# Altium schematic sheet power.SchDoc
size A
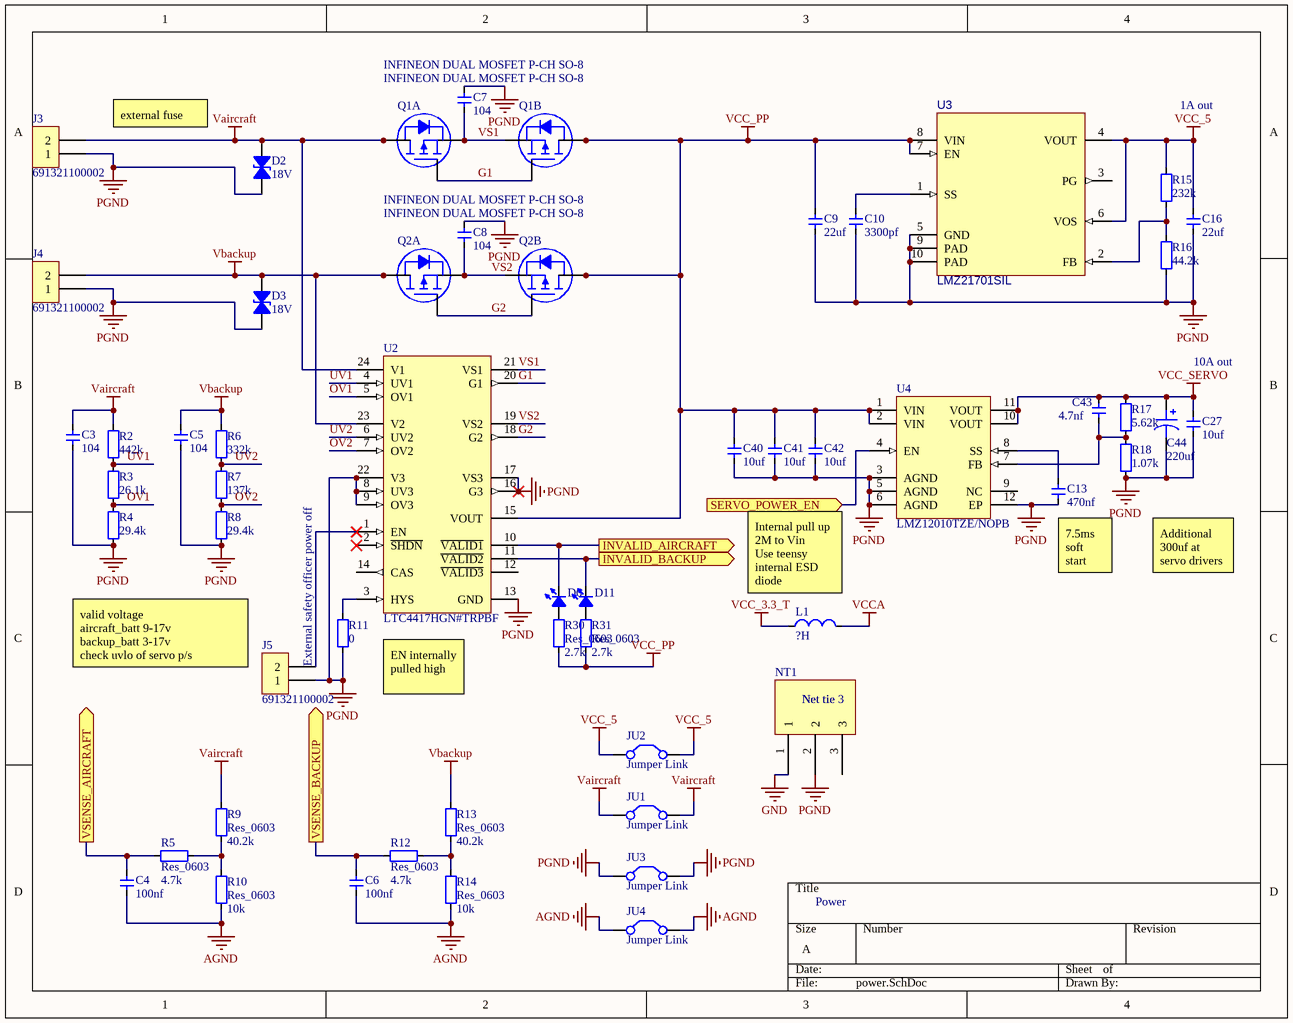
[diagram p0: power.SchDoc]

## Parts
C3  value 104  [CAP_0603]  (hidden comment: Cap_0603)
C4  value 100nf  [CAP_0603]  (hidden comment: Cap_0603)
C5  value 104  [CAP_0603]  (hidden comment: Cap_0603)
C6  value 100nf  [CAP_0603]  (hidden comment: Cap_0603)
C7  value 104  [CAP_0603]  (hidden comment: Cap_0603)
C8  value 104  [CAP_0603]  (hidden comment: Cap_0603)
C9  value 22uf  [CAP_0805]  (hidden comment: Cap_0805)
C10  value 3300pf  [CAP_0603]  (hidden comment: Cap_0603)
C13  value 470nf  [CAP_0603]  (hidden comment: Cap_0603)
C16  value 22uf  [CAP_0805]  (hidden comment: Cap_0805)
C27  value 10uf  [CAP_0805]  (hidden comment: Cap_0805)
C40  value 10uf  [CAP_0805]  (hidden comment: Cap_0805)
C41  value 10uf  [CAP_0805]  (hidden comment: Cap_0805)
C42  value 10uf  [CAP_0805]  (hidden comment: Cap_0805)
C43  value 4.7nf  [CAP_0603]  (hidden comment: Cap_0603)
C44  220uf  [CAP ALUM 8.3MM]
D2  18V  [SOD123F]
D3  18V  [SOD123F]
D6  LED_0603  [LED_0603_GREEN]  (value not drawn)
D11  LED_0603  [LED_0603_GREEN]  (value not drawn)
J3  691321100002  [691322110002]
J4  691321100002  [691322110002]
J5  691321100002  [62000211121]
JU1  Jumper Link  [jumper_56.5]
JU2  Jumper Link  [jumper_43.5]
JU3  Jumper Link  [jumper_12]
JU4  Jumper Link  [jumper_52]
L1  value ?H  [IND_0603]  (hidden comment: Ind_0603)
NT1  Net tie 3  [Net tie 3]  (net tie, no BOM)
Q1  INFINEON DUAL MOSFET P-CH SO-8  [INFINEON SO-8]  (parts A,B of 2)
Q2  INFINEON DUAL MOSFET P-CH SO-8  [INFINEON SO-8]  (parts A,B of 2)
R2  value 442k  [RES_0603]  (hidden comment: Res_0603)
R3  value 26.1k  [RES_0603]  (hidden comment: Res_0603)
R4  value 29.4k  [RES_0603]  (hidden comment: Res_0603)
R5  Res_0603  value 4.7k  [RES_0603]
R6  value 332k  [RES_0603]  (hidden comment: Res_0603)
R7  value 137k  [RES_0603]  (hidden comment: Res_0603)
R8  value 29.4k  [RES_0603]  (hidden comment: Res_0603)
R9  Res_0603  value 40.2k  [RES_0603]
R10  Res_0603  value 10k  [RES_0603]
R11  value 0  [RES_0603]  (hidden comment: Res_0603)
R12  Res_0603  value 4.7k  [RES_0603]
R13  Res_0603  value 40.2k  [RES_0603]
R14  Res_0603  value 10k  [RES_0603]
R15  value 232k  [RES_0603]  (hidden comment: Res_0603)
R16  value 44.2k  [RES_0603]  (hidden comment: Res_0603)
R17  value 5.62k  [RES_0603]  (hidden comment: Res_0603)
R18  value 1.07k  [RES_0603]  (hidden comment: Res_0603)
R30  Res_0603  value 2.7k  [RES_0603]
R31  Res_0603  value 2.7k  [RES_0603]
U2  LTC4417HGN#TRPBF  [LT-GN-24_N]
U3  LMZ21701SIL  [LMZ21701SIL]
U4  LMZ12010TZE/NOPB  [TZA11A_V]

## Ports
INVALID_AIRCRAFT (out), INVALID_BACKUP (out), SERVO_POWER_EN (in), VSENSE_AIRCRAFT (out), VSENSE_BACKUP (out)

## Nets
AGND: C4.1 C6.1 JU4.1(C1) JU4.2(C2) R10.1 R14.1
GND: NT1.1
PGND: C3.1 C5.1 C7.2 C8.2 C9.1 C10.1 C13.1 C16.1 C27.1 C40.1 C41.1 C42.1 C44.2 D2.1 D3.1 J3.1 J4.1 J5.1 JU3.1(C1) JU3.2(C2) NT1.2 R4.1 R8.1 R11.1 R16.1 R18.1 U2.8(UV3) U2.9(OV3) U2.13(GND) U2.16(G3) U2.17(VS3) U2.22(V3) U3.5(GND) U3.9(PAD) U3.10(PAD) U4.3(AGND) U4.5(AGND) U4.6(AGND) U4.12(EP)
Vaircraft: C3.2 D2.2 J3.2 JU1.1(C1) JU1.2(C2) Q1.7(D1) Q1.8(D1) R2.2 R9.2 U2.24(V1)
Vbackup: C5.2 D3.2 J4.2 Q2.7(D1) Q2.8(D1) R6.2 R13.2 U2.23(V2)
VCC_3.3_T: L1.1
VCC_5: C16.2 JU2.1(C1) JU2.2(C2) R15.2 U3.4(VOUT) U3.6(VOS)
VCC_PP: C9.2 C40.2 C41.2 C42.2 Q1.5(D2) Q1.6(D2) Q2.5(D2) Q2.6(D2) R30.1 R31.1 U2.15(VOUT) U3.7(EN) U3.8(VIN) U4.1(VIN) U4.2(VIN)
VCC_SERVO: C27.2 C43.2 C44.1 R17.2 U4.10(VOUT) U4.11(VOUT)
VCCA: L1.2
G1: Q1.2(G1) Q1.4(G2) U2.20(G1)
G2: Q2.2(G1) Q2.4(G2) U2.18(G2)
INVALID_AIRCRAFT: D6.2(K) U2.10(~{VALID1}) ; port INVALID_AIRCRAFT
INVALID_BACKUP: D11.2(K) U2.11(~{VALID2}) ; port INVALID_BACKUP
OV1: R3.1 R4.2 U2.5(OV1)
OV2: R7.1 R8.2 U2.7(OV2)
SERVO_POWER_EN: U4.4(EN) ; port SERVO_POWER_EN
UV1: R2.1 R3.2 U2.4(UV1)
UV2: R6.1 R7.2 U2.6(UV2)
VS1: C7.1 Q1.1(S1) Q1.3(S2) U2.21(VS1)
VS2: C8.1 Q2.1(S1) Q2.3(S2) U2.19(VS2)
VSENSE_AIRCRAFT: C4.2 R5.1 ; port VSENSE_AIRCRAFT
VSENSE_BACKUP: C6.2 R12.1 ; port VSENSE_BACKUP
NetC10_2: C10.2 U3.1(SS)
NetC13_2: C13.2 U4.8(SS)
NetC43_1: C43.1 R17.1 R18.2 U4.7(FB)
NetD6_1: D6.1(A) R30.2
NetD11_1: D11.1(A) R31.2
NetJ5_2: J5.2 U2.1(EN)
NetR5_2: R5.2 R9.1 R10.2
NetR11_2: R11.2 U2.3(HYS)
NetR12_2: R12.2 R13.1 R14.2
NetR15_1: R15.1 R16.2 U3.2(FB)

Not connected (* = marked no-connect by the designer): NT1 3; U2 2(~{SHDN})* 12(~{VALID3}) 14(CAS); U3 3(PG); U4 9(NC)

## Notes on the sheet
- external fuse
- 1A out
- 10A out
- (near C13) 7.5ms soft start
- Additional 300uf at servo drivers
- Internal pull up 2M to Vin
  Use teensy internal ESD diode
- valid voltage
  aircraft_batt 9-17v
  backup_batt 3-17v
  check uvlo of servo p/s
- (near J5) External safety officer power off
- EN internally pulled high
- Power

## Library data of the parts
C3-C8 C10 C13 C43 = Cap_0603: Capacitor
C9 C16 C27 C40-C42 = Cap_0805: Capacitor
C44 = Polarised Capacitor: EEE-HA1V221UP; Value: 220uf
D2 D3 = Diode Zener Bidirectional: Bidirectional Zener Diode
D6 D11 = LED_0603: LED
J3-J5 = 691321100002: WR-TBL Terminal block - serie 3211 - 3.50 mm; Manufacturer: Würth Elektronik eiSos GmbH; ComponentLink1 Description: Manufacturer; ComponentLink2 Description: Datasheet; NoPins: 2; Created Date: 9 December 2013; partNo: 691321100002; ComponentLink1URL: http://www.we-online.com; ComponentLink2URL: http://katalog.we-online.de/em/datasheet/6913211000xx.pdf; Created by: Karrer Zheng
JU1-JU4 = Jumper: Jumper Wire; Published: 24-Mar-1999; LatestRevisionDate: 17-Jul-2002; LatestRevisionNote: Re-released for DXP Platform.; PackageReference: RAD-0.2; Publisher: Altium Limited; PackageDescription: Radial Cap, Thru-Hole; 2 Leads; 0.2 in Pin Spacing; ClassName: no-clearance-check
L1 = Ind_0603: Inductor
NT1 = Net tie
R2-R18 R30 R31 = Res_0603: Resistor
U2 = LTC4417HGN#TRPBF: Prioritized PowerPath Controller, 2.5 to 36 V Vin, 24-pin SOP (GN-24), -40 to 125 degC, Pb-Free, Tape and Reel; Manufacturer: Linear Technology; Ideal Diode: Triple, External, P-Channel; PackageVersion: Rev. B, 03/2012; PackageReference: GN24; PackageDescription: 24-Pin Plastic SSOP , Body 8.5 x 3.9 mm, Pitch 0.635 mm; Supplier 1: Digi-Key; Supplier Part Number 1: LTC4417HGN#TRPBF-ND; Supplier 2: Newark; Supplier Part Number 2: 53W0557; Packing: Tape and Reel; RoHS: TRUE; Mounting Technology: Surface Mount; PartNumber: LTC4417HGN#TRPBF; ComponentLink1Description: Manufacturer URL; ComponentLink1URL: http://www.linear.com/; ComponentLink2Description: Datasheet; ComponentLink2URL: http://cds.linear.com/docs/en/datasheet/4417f.pdf; ComponentLink3Description: Package Specification; ComponentLink3URL: http://cds.linear.com/docs/en/packaging/05081641_B_GN24.pdf
U3 = LMZ21701SIL: 1A SIMPLE SWITCHER Nano Module with 17V Maximum Input Voltage, SIL0008E; Alternate Manufacturer: None; Manufacturer: Texas Instruments; SymbolCreator: a0411947; CompType: IC; U/M: EA; SymbolVersion: 2013-08-23; PartNumber: LMZ21701SIL; PackageReference: SIL0008E; MountType: SMT; ComponentLink1Description: Datasheet Link; ComponentLink1URL: https://sps06.itg.ti.com/sites/KMS/crossdivteams/altium/docs/ComponentDatasheets/LMZ21701_DS_2013_07_10.pdf; RoHS: Y; Publisher: Texas Instruments; LatestRevisionDate: 2014-08-23
U4 = LMZ12010TZE/NOPB: 10A, SIMPLE SWITCHER® Power Module with 20V Maximum Input, 11 pin TO-PMOD, 250 Reel; Manufacturer: National Semiconductor; PackageTopMarking: NSUZXYTTE#*LMZ12010; PowerWise: N; High-Reliability: Y; DatasheetVersion: Apr-2011; PackageVersion: revE, Apr-2011; PackageReference: TZA11A; PackageDescription: TO-PMOD, 15 x 15 x 5.9 mm Body, 11 Lead, 1.27 mm Pitch, Surface Mount; PartNumber: LMZ12010TZE/NOPB; RoHS: Y; PinCount: 11; CompType: Switcher; ComponentLink1Description: Manufacturer URL; ComponentLink1URL: http://www.national.com/; ComponentLink2Description: LMZ12010 Datasheet; ComponentLink2URL: http://www.national.com/ds/LM/LMZ12010.pdf; ComponentLink3Description: LMZ12010 Web Page; ComponentLink3URL: http://www.national.com/pf/LM/LMZ12010.html; ComponentLink4Description: TZA11A Package Page; ComponentLink4URL: http://www.national.com/packaging/folders/tza11a.html